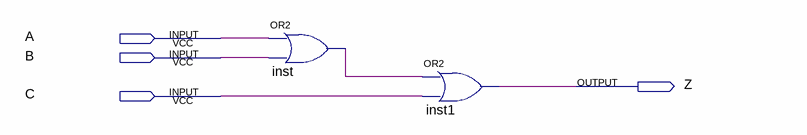
[diagram p0: schematic sheet]
// Quartus schematic One-Chip_Logic_Circuit.bdf as structural Verilog: 2 symbols, 4 pins
module \One-Chip_Logic_Circuit  (
  input  A,
  input  B,
  input  C,
  output Z
);

  wire inst_out;

  or inst (inst_out, A, B);
  or inst1 (Z, inst_out, C);
endmodule
